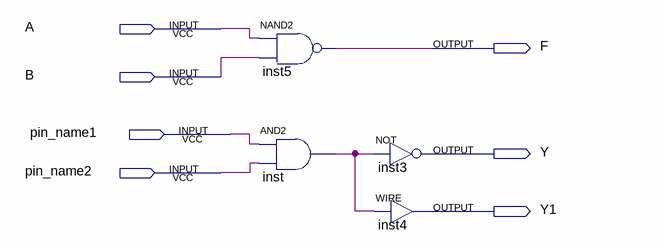
[diagram p0: schematic sheet]
// Quartus schematic Work1.bdf as structural Verilog: 4 symbols, 7 pins
module Work1 (
  input  A,
  input  B,
  input  pin_name1,
  input  pin_name2,
  output F,
  output Y,
  output Y1
);

  wire inst_out;

  nand inst5 (F, A, B);
  and inst (inst_out, pin_name1, pin_name2);
  not inst3 (Y, inst_out);
  assign Y1 = inst_out;  // WIRE inst4
endmodule
